# Altium schematic sheet POF.SchDoc
size A3; SheetNumber: 2
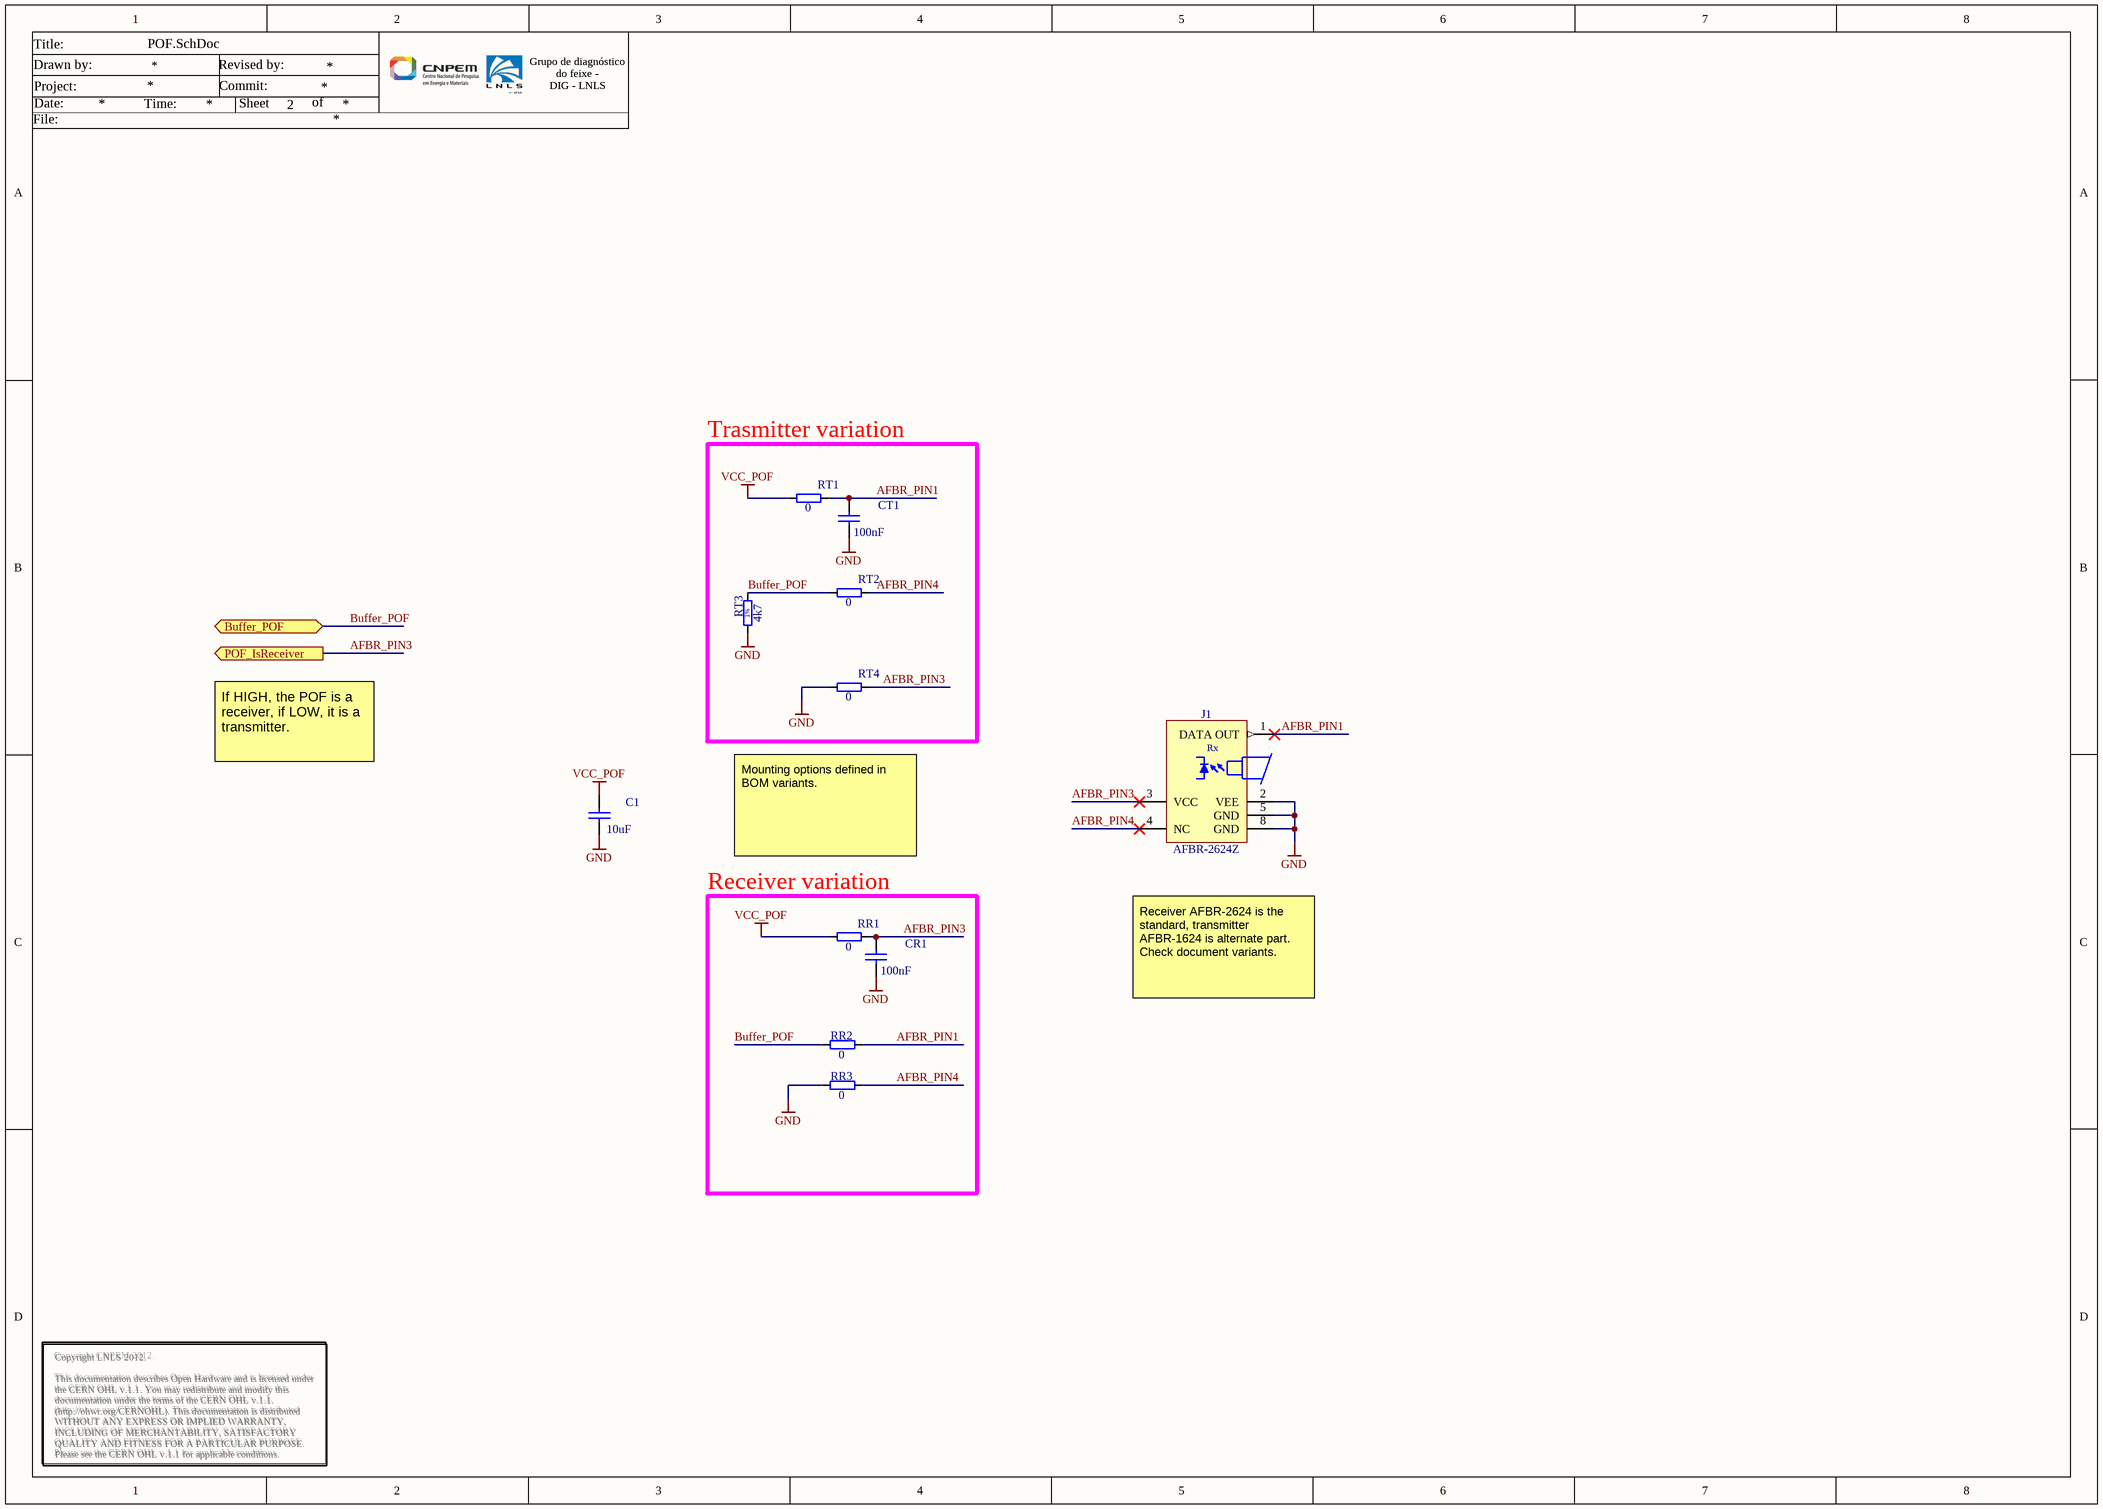
[diagram p0: POF.SchDoc]

## Parts
C1  10uF  [CAPC2012X135N]
CR1  100nF  [CAPC1005X55N]
CT1  100nF  [CAPC1005X55N]
J1  AFBR-2624Z  [AFBR-x624Z]
RR1  0  [RESC1005X40N]
RR2  0  [RESC1005X40N]
RR3  0  [RESC1005X40N]
RT1  0  [RESC1005X40N]
RT2  0  [RESC1005X40N]
RT3  4k7  [RESC1005X40N]
RT4  0  [RESC1005X40N]

## Blocks framed on the sheet
Trasmitter variation: CT1 RT1-RT4
Receiver variation: CR1 RR1-RR3

## Ports
Buffer_POF (bidir), POF_IsReceiver (out)

## Nets
GND: C1.1 CR1.1 CT1.1 J1.2(VEE) J1.5(GND) J1.8(GND) RR3.1 RT3.1 RT4.1
VCC_POF: C1.2 RR1.1 RT1.1
AFBR_PIN1: CT1.2 J1.1(DATA_OUT) RR2.2 RT1.2
AFBR_PIN3: CR1.2 J1.3(VCC) RR1.2 RT4.2 ; port POF_IsReceiver
AFBR_PIN4: J1.4(NC) RR3.2 RT2.2
Buffer_POF: RR2.1 RT2.1 RT3.2 ; port Buffer_POF

## Notes on the sheet
- Title:
- Date:
- Project:
- Drawn by:
- Time:
- Commit:
- Revised by:
- Sheet
- of
- Grupo de diagnóstico do feixe -
  DIG - LNLS
- File:
- If HIGH, the POF is a receiver, if LOW, it is a transmitter.
- Mounting options defined in BOM variants.
- Receiver AFBR-2624 is the standard, transmitter AFBR-1624 is alternate part. Check document variants.
- Copyright LNLS 2012.
  This documentation describes Open Hardware and is licensed under the CERN OHL v.1.1. You may redistribute and modify this documentation under the terms of the CERN OHL v.1.1. (http://ohwr.org/CERNOHL). This documentation is distributed WITHOUT ANY EXPRESS OR IMPLIED WARRANTY, INCLUDING OF MERCHANTABILITY, SATISFACTORY QUALITY AND FITNESS FOR A PARTICULAR PURPOSE. Please see the CERN OHL v.1.1 for applicable conditions.
- Copyright CNPEM 2012.
  This documentation describes Open Hardware and is licensed under the CERN OHL v.1.1. You may redistribute and modify this documentation under the terms of the CERN OHL v.1.1. (http://ohwr.org/CERNOHL). This documentation is distributed WITHOUT ANY EXPRESS OR IMPLIED WARRANTY, INCLUDING OF MERCHANTABILITY, SATISFACTORY QUALITY AND FITNESS FOR A PARTICULAR PURPOSE. Please see the CERN OHL v.1.1 for applicable conditions.
- (in symbol AFBR-2624Z) Rx
- (in symbol R0402_4K7_1%_0.0625W_100PPM) 1%

## Library data of the parts
C1 = CC0805_10UF_10V_10%_X7R: Non-polarised capacitor; Part Description: SMD Multilayer Chip Ceramic Capacitor; Manufacturer: GENERIC; Manufacturer1 Part Number: GRM21BR71A106KE51L; Voltage: 10V; TC: X7R; Tolerance: ±10%; Part Number: CC0805_10UF_10V_10%_X7R; Component Kind: Standard; Component Type: Standard; Pin Count: 2; Value: 10uF; Status: Preferred; Manufacturer Part Number: CC0805_10UF_10V_10%_X7R; Case: 0805; Mounted: Yes; Socket: No; SMD: Yes; Sense: No; Manufacturer1 Example: MURATA; Manufacturer1 ComponentHeight: 1.35mm; HelpURL: \\cern.ch\dfs\Applications\Altium\Datasheets\CC0805_X7R_MURATA.pdf; Author: CERN DEM JLC; CreateDate: 30/04/2012; LatestRevisionDate: 30/04/2012
CR1 CT1 = CC0402_100NF_16V_10%_X5R: Non-polarised capacitor; Part Description: SMD Multilayer Chip Ceramic Capacitor; Manufacturer: GENERIC; Manufacturer1 Part Number: GRM155R61C104KA88D; Voltage: 16V; TC: X5R; Tolerance: ±10%; Part Number: CC0402_100NF_16V_10%_X5R; Component Kind: Standard; Component Type: Standard; Pin Count: 2; Value: 100nF; Status: None; Manufacturer Part Number: CC0402_100NF_16V_10%_X5R; Case: 0402; Mounted: Yes; Socket: No; SMD: Yes; Sense: No; Manufacturer1 Example: MURATA; Manufacturer1 ComponentHeight: 0.55mm; HelpURL: \\cern.ch\dfs\Applications\Altium\Datasheets\CC0402_X5R_MURATA_GRM.pdf; Author: CERN DEM JLC; CreateDate: 10/12/2013; LatestRevisionDate: 10/12/2013
J1 = AFBR-2624Z: DC-50MBd Versatile Link Fiber Optic Receiver for 1 mm POF and 200 µm PCS; Manufacturer: AVAGO TECHNOLOGIES; PressFit: No; Part Number: AFBR-2624Z; Component Kind: Standard; Component Type: Standard; Device: AFBR-2624Z; Pin Count: 6; Family: Optical Fiber; Mounted: Yes; Socket: No; SMD: No; Sense: No; Status: None; Part Description: DC-50MBd Versatile Link Fiber Optic Receiver for 1 mm POF and 200 µm PCS; Manufacturer Part Number: AFBR-2624Z; ComponentHeight: 7.62mm; HelpURL: \\cern.ch\dfs\Applications\Altium\Datasheets\AFBR-2624Z.pdf; Author: CERN DEM MR; CreateDate: 18/05/2016; LatestRevisionDate: 18/05/2016
RR1-RR3 RT1 RT2 RT4 = R0402_0R_JUMPER: Resistor; Part Description: 1A (0.05R Max DC Resistance) Zero Ohm Jumper; Manufacturer: GENERIC; Manufacturer1 Part Number: 232270591001L; Part Number: R0402_0R_JUMPER; Component Kind: Standard; Component Type: Standard; Pin Count: 2; Value: 0; Status: Not recommended; Manufacturer Part Number: R0402_0R_JUMPER; Case: 0402; Mounted: Yes; Sense: No; Socket: No; SMD: Yes; Manufacturer1 Example: YAGEO PHYCOMP; Manufacturer1 ComponentHeight: 0.4mm; HelpURL: \\cern.ch\dfs\Applications\Altium\Datasheets\R0402_Phycomp_RC0402.pdf; Author: CERN DEM JLC; CreateDate: 03/12/2007; LatestRevisionDate: 17/10/2012
RT3 = R0402_4K7_1%_0.0625W_100PPM: Resistor - 1%; Part Description: General Purpose Thick Film Chip Resistor; Manufacturer: GENERIC; Manufacturer1 Part Number: 232270674702L; TC: ±100ppm/°C; Part Number: R0402_4K7_1%_0.0625W_100PPM; Component Kind: Standard; Component Type: Standard; Pin Count: 2; Value: 4k7; Status: Not recommended; Power: 0.0625W; Tolerance: ±1%; Manufacturer Part Number: R0402_4K7_1%_0.0625W_100PPM; Case: 0402; Mounted: Yes; Sense: No; Socket: No; SMD: Yes; Manufacturer1 Example: YAGEO PHYCOMP; Manufacturer1 ComponentHeight: 0.4mm; HelpURL: \\cern.ch\dfs\Applications\Altium\Datasheets\R0402_Phycomp_RC0402.pdf; Author: CERN DEM JLC; CreateDate: 03/12/2007; LatestRevisionDate: 17/10/2012